# Altium schematic sheet BMS.SchDoc
size A4; SheetNumber: 3; SheetTotal: 21
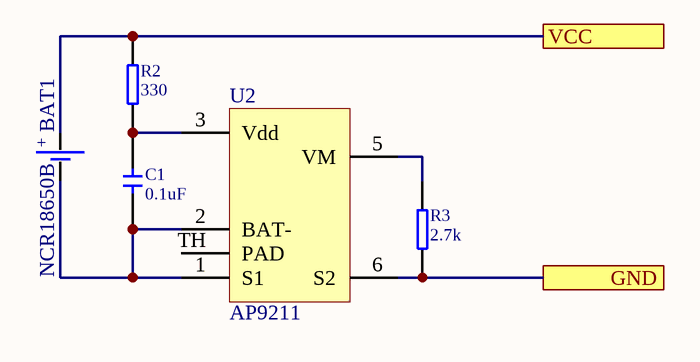
[diagram p0: BMS.SchDoc]

## Parts
BAT1  NCR18650B  [BAT_18650_CLIPS]
C1  value 0.1uF  [CERCAP 0402]
R2  value 330  [RES 0402]
R3  value 2.7k  [RES 0402]
U2  AP9211  [DFN-8-2x3]

## Ports
GND, VCC

## Nets
GND: R3.1 U2.6(S2) ; port GND
VCC: BAT1.A R2.2 ; port VCC
NetBAT1_K: BAT1.K C1.1 U2.1(S1) U2.2(BAT-)
NetC1_2: C1.2 R2.1 U2.3(Vdd)
NetR3_2: R3.2 U2.5(VM)

Not connected (* = marked no-connect by the designer): U2 TH(PAD)

## Notes on the sheet
- (in symbol !Battery) +

## Library data of the parts
BAT1 = !Battery: generic battery
C1 = !Capacitor: Capacitor; IsSMT: NoSMT; Voltage: 50V; Diel: X7R
R2 R3 = !Resistor: Resistor; IsSMT: NoSMT
U2 = AP9211: BMS with built-in keys; IsSMT: NoSMT; Order: *; LCSC Part #: *; BuyLink1: *